# EAGLE schematic oresatt-batteries (EAGLE 7.5.0)
Oresat Battery Management Board v0 Andrew Greenberg Austin Joseph Haneef Mubarak
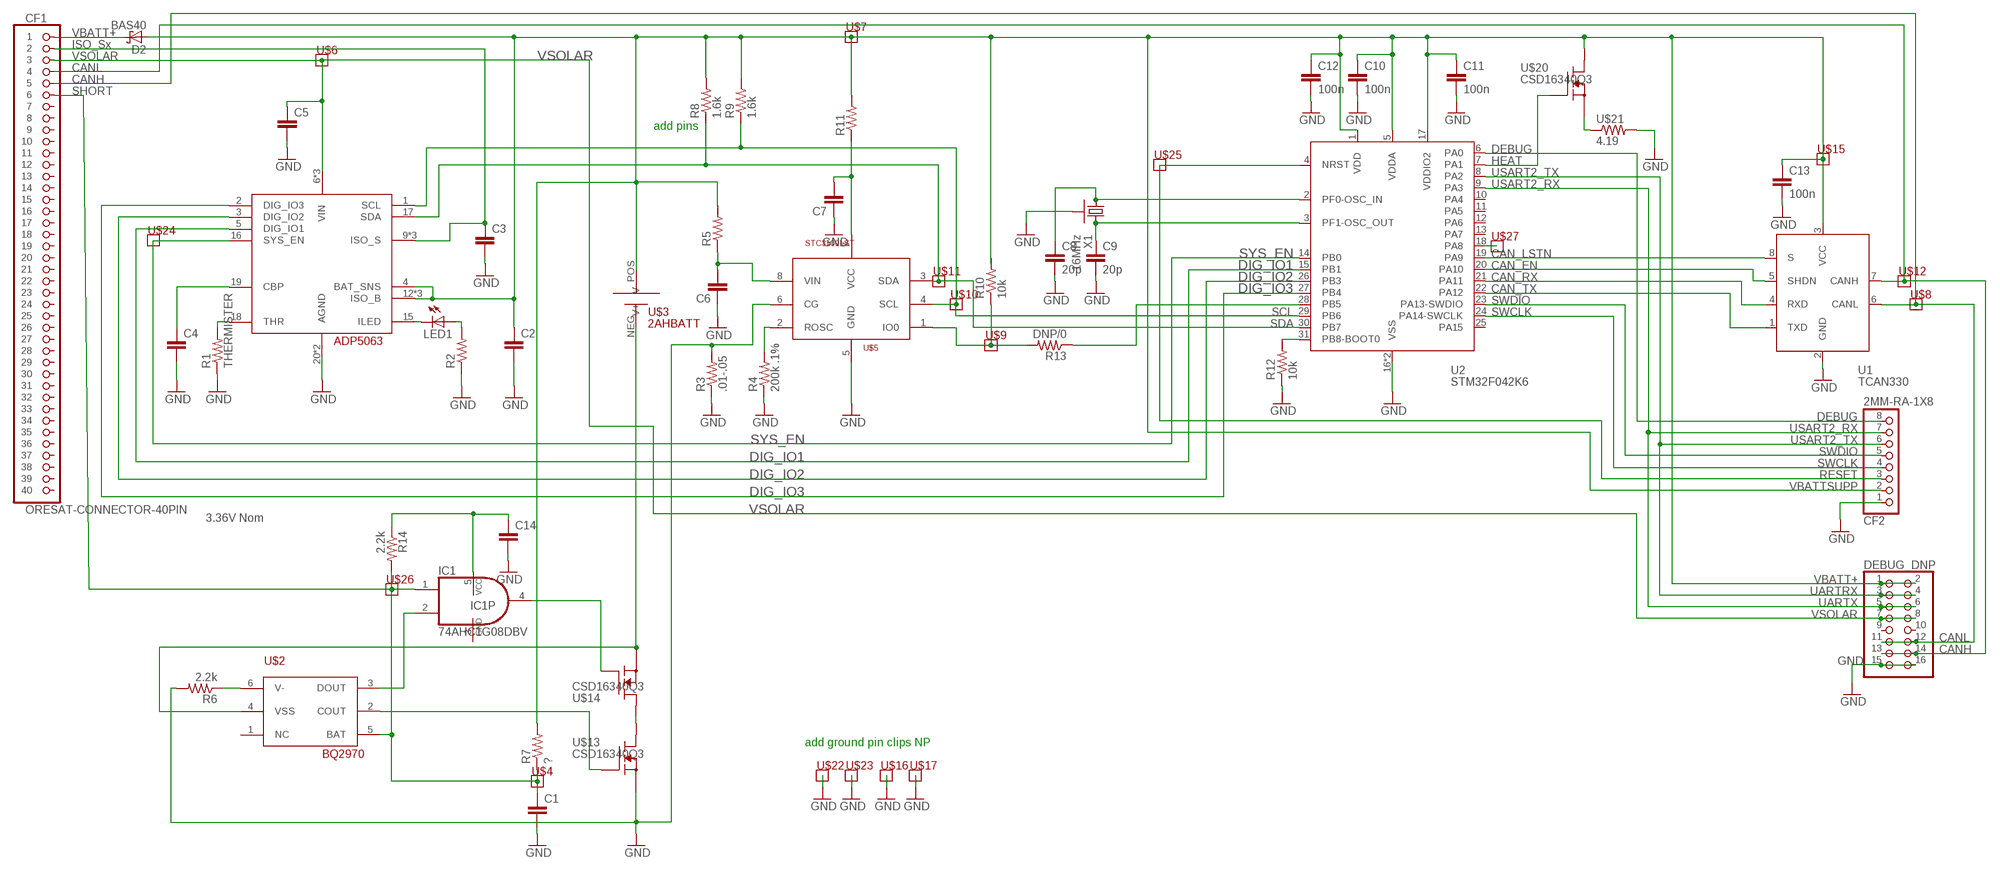
[diagram p0: schematic, sheet 1]

## Parts
C1  C-EUC0603  [C0603]
C2  C-EUC0603  [C0603]
C3  C-EUC0603  [C0603]
C4  C-EUC0603  [C0603]
C5  C-EUC0603  [C0603]
C6  C-EUC0603  [C0603]
C7  C-EUC0603  [C0603]
C8  20p  C-EUC0603  [C0603]
C9  20p  C-EUC0603  [C0603]
C10  100n  C-EUC0603  [C0603]
C11  100n  C-EUC0603  [C0603]
C12  100n  C-EUC0603  [C0603]
C13  100n  C-EUC0603  [C0603]
C14  C-EUC0603  [C0603]
CF1  ORESAT-CONNECTOR-40PIN  [HARWIN-ARCHER-M50-3202045]
CF2  2MM-RA-1X8  [CF-2MM-RA-1X8-PRECIDIP-831]
D2  BAS40  [SOT23]
DEBUG_DNP  PINHD-2X8  [2X08]
IC1  74AHC1G08DBV  [SOT23-5]
LED1  LEDCHIPLED_0603  [CHIPLED_0603]
R1  THERMISTER  R-US_R0603  [R0603]
R2  R-US_R0603  [R0603]
R3  .01-.05  R-US_R0603  [R0603]
R4  200k .1%  R-US_R0603  [R0603]
R5  R-US_R0603  [R0603]
R6  2.2k  R-US_R0603  [R0603]
R7  ?  R-US_R0603  [R0603]
R8  1.6k  R-US_R0603  [R0603]
R9  1.6k  R-US_R0603  [R0603]
R10  10k  R-US_R0603  [R0603]
R11  R-US_R0603  [R0603]
R12  10k  R-US_R0603  [R0603]
R13  DNP/0  R-US_R0603  [R0603]
R14  2.2k  R-US_R0603  [R0603]
U1  TCAN330  [SOT23-8_TI-DCN]
U2  STM32F042K6  [QFP32-7X7]
U$1  ADP5063  [20_4X4_VVTQ]
U$2  BQ2970  [PSOP6]
U$3  2AHBATT  [2AH_605060]
U$4  TP  [2MM_TP]
U$5  STC3100LST  [MINISO-8]
U$6  TP  [2MM_TP]
U$7  TP  [2MM_TP]
U$8  TP  [2MM_TP]
U$9  TP  [2MM_TP]
U$10  TP  [2MM_TP]
U$11  TP  [2MM_TP]
U$12  TP  [2MM_TP]
U$13  CSD16340Q3  [Q3]
U$14  CSD16340Q3  [Q3]
U$15  TP  [2MM_TP]
U$16  TP  [2MM_TP]
U$17  TP  [2MM_TP]
U$20  CSD16340Q3  [Q3]
U$21  4.19  RES_HEATER  [RES_HEATER]
U$22  TP  [2MM_TP]
U$23  TP  [2MM_TP]
U$24  TP  [2MM_TP]
U$25  TP  [2MM_TP]
U$26  TP  [2MM_TP]
U$27  TP  [2MM_TP]
X1  16MHz  CRYSTAL-WITH-GND  [CRYSTAL_2.5X2]

## Nets
ADP_CBP: C4.1 U$1.19(CBP)
ADP_LED: LED1.C U$1.15(ILED)
ADP_THR: R1.2 U$1.18(THR)
BETSHUT: U$13.P$5(D) U$13.P$6(D) U$13.P$7(D) U$13.P$8(D) U$13.P$9(D) U$14.P$5(D) U$14.P$6(D) U$14.P$7(D) U$14.P$8(D) U$14.P$9(D)
BQBAT: C1.1 CF1.P$6 IC1.1(I0) R7.1 R14.2 U$2.5(BAT)
BQVMIN: R6.1 U$2.6(V-)
CAN_EN: U1.5(SHDN) U2.20(PA10)
CAN_LSTN: U1.8(S) U2.19(PA9)
CAN_RX: U1.4(RXD) U2.21(PA11)
CAN_TX: U1.1(TXD) U2.22(PA12)
CANH: CF1.P$4 DEBUG_DNP.13 DEBUG_DNP.14 U1.7(CANH)
CANL: CF1.P$5 DEBUG_DNP.11 DEBUG_DNP.12 U1.6(CANL)
COUT: U$2.2(COUT) U$13.P$4(G)
DIG_IO1: U2.15(PB1) U$1.5(DIG_IO1)
DIG_IO2: U2.26(PB3) U$1.3(DIG_IO2)
DIG_IO3: U2.27(PB4) U$1.2(DIG_IO3)
GND: C1.2 C2.2 C3.2 C4.2 C5.2 C6.1 C7.1 C8.2 C9.2 C10.2 C11.2 C12.2 C13.2 C14.2 CF2.1 DEBUG_DNP.15 DEBUG_DNP.16 R1.1 R2.1 R3.1 R3.2 R4.1 R6.2 R12.1 U1.2(GND) U2.16(VSS) U2.32(VSS) U$1.20(AGND) U$1.P$1(AGND) U$5.5(GND) U$5.6(CG) U$13.P$1(S) U$13.P$2(S) U$13.P$3(S) U$21.V- X1.2(SHIELD) X1.4(SHIELD)
HEAT: U2.7(PA1) U$20.P$4(G)
IO0: R10.1 R13.2 U$5.1(IO0)
ISO_S: C3.1 CF1.P$2 U$1.9(ISO_S) U$1.10(ISO_S) U$1.11(ISO_S)
LEDNP: LED1.A R2.2
N$1: C7.2 R11.1 U$5.7(VCC)
N$2: R12.2 U2.31(PB8-BOOT0)
N$3: IC1.4(O) U$14.P$4(G)
N$4: CF1.P$1 D2.3(C)
N$5: IC1.2(I1) U$2.3(DOUT)
N$6: C14.1 IC1.5(VCC) R14.1
N$13: U$20.P$1(S) U$20.P$2(S) U$20.P$3(S) U$21.V+
NRESET: CF2.3 U2.4(NRST)
OSC_IN: C8.1 U2.2(PF0-OSC_IN) X1.1
OSC_OUT: C9.1 U2.3(PF1-OSC_OUT) X1.3
PA8: U2.18(PA8)
ROSC: R4.2 U$5.2(ROSC)
SCL: R9.1 U2.29(PB6) U$1.1(SCL) U$5.4(SCL)
SDA: R8.1 U2.30(PB7) U$1.17(SDA) U$5.3(SDA)
STC_CG: U$2.4(VSS) U$3.NEG(V-) U$14.P$1(S) U$14.P$2(S) U$14.P$3(S)
STC_IO: R13.1 U2.28(PB5)
STC_VIN: C6.2 R5.1 U$5.8(VIN)
STM_DEBUG: CF2.8 U2.6(PA0)
SWCLK: CF2.4 U2.24(PA14-SWCLK)
SWDIO: CF2.5 U2.23(PA13-SWDIO)
SYS_EN: U2.14(PB0) U$1.16(SYS_EN)
USART2_RX: CF2.7 DEBUG_DNP.5 DEBUG_DNP.6 U2.9(PA3)
USART2_TX: CF2.6 DEBUG_DNP.3 DEBUG_DNP.4 U2.8(PA2)
VBATT+: C2.1 C10.1 C11.1 C12.1 C13.1 CF2.2 D2.1(A) DEBUG_DNP.1 DEBUG_DNP.2 R5.2 R7.2 R8.2 R9.2 R11.2 U1.3(VCC) U2.1(VDD) U2.5(VDDA) U2.17(VDDIO2) U$1.4(BAT_SNS) U$1.12(ISO_B) U$1.13(ISO_B) U$1.14(ISO_B) U$3.POS(V+) U$20.P$5(D) U$20.P$6(D) U$20.P$7(D) U$20.P$8(D) U$20.P$9(D)
VSOLAR: C5.1 CF1.P$3 DEBUG_DNP.7 DEBUG_DNP.8 U$1.6(VIN) U$1.7(VIN) U$1.8(VIN)
Unconnected: CF1.P$7 CF1.P$8 CF1.P$9 CF1.P$10 CF1.P$11 CF1.P$12 CF1.P$13 CF1.P$14 CF1.P$15 CF1.P$16 CF1.P$17 CF1.P$18 CF1.P$19 CF1.P$20 CF1.P$21 CF1.P$22 CF1.P$23 CF1.P$24 CF1.P$25 CF1.P$26 CF1.P$27 CF1.P$28 CF1.P$29 CF1.P$30 CF1.P$31 CF1.P$32 CF1.P$33 CF1.P$34 CF1.P$35 CF1.P$36 CF1.P$37 CF1.P$38 CF1.P$39 CF1.P$40 DEBUG_DNP.9 DEBUG_DNP.10 R10.2 U2.10(PA4) U2.11(PA5) U2.12(PA6) U2.13(PA7) U2.25(PA15) U$2.1(NC)

## Notes on the sheet
- VBATT+
- ISO_Sx
- VSOLAR | VSOLAR
- CANL
- CANH
- SHORT
- add pins
- DEBUG
- HEAT
- USART2_TX
- USART2_RX
- SYS_EN | CAN_LSTN
- DIG_IO1 | CAN_EN
- DIG_IO2 | CAN_RX
- DIG_IO3 | CAN_TX
- SWDIO
- SCL | SWCLK
- SDA
- DEBUG
- USART2_RX
- SYS_EN | USART2_TX
- SWDIO
- DIG_IO1
- SWCLK
- DIG_IO2 | RESET
- VBATTSUPP
- DIG_IO3
- 3.36V Nom | VSOLAR
- VBATT+
- UARTRX
- UARTX
- VSOLAR
- CANL
- CANH
- GND
- add ground pin clips NP

## Power pins joined to a net without a drawn wire
GND: IC1.3(GND)

## Library data of the parts
C1-C14 = rcl:C-EU: CAPACITOR, European symbol
CF1 = low-gain-radio:ORESAT-CONNECTOR-40PIN: OreSat 40pin card connector. Uses the Harwin Archer M50-3202045.
CF2 = oresat-batteries:2MM-RA-1X8
D2 = diode:BAS40: Silicon Schottky Diodes General-purpose diode for high-speed switching
DEBUG_DNP = pinhead:PINHD-2X8: PIN HEADER
IC1 = 74xx-little-us:74*1G08: 2-input AND gate
LED1 = led:LED: LED OSRAM: - CHIPLED LG R971, LG N971, LY N971, LG Q971, LY Q971, LO R971, LY R971 LH N974, LH R974 LS Q976, LO Q976, LY Q976 LO Q996 - Hyper CHIPLED LW Q18S LB Q993, LB Q99A, LB R99A - SideLED LS A670, LO A670, LY A670, LG A670, LP A670 LB A673, LV A673, LT A673, LW A673 LH A674 LY A675 LS A676, LA A676, LO A676, LY A676, LW A676 LS A679, LY A679, LG A679 - Hyper Micro SIDELED® LS Y876, LA Y876, LO Y876, LY Y876 LT Y87S - SmartLED LW L88C, LW L88S LB L89C, LB L89S, LG L890 LS L89K, LO L89K, LY L89K LS L896, LA L896, LO L896, LY L896 - TOPLED LS T670, LO T670, LY T670, LG T670, LP T670 LSG T670, LSP T670, LSY T670, LOP T670, LYG T670 LG T671, LOG T671, LSG T671 LB T673, LV T673, LT T673, LW T673 LH T674 LS T676, LA T676, LO T676, LY T676, LB T676, LH T676, LSB T676, LW T676 LB T67C, LV T67C, LT T67C, LS T67K, LO T67K, LY T67K, LW E67C LS E67B, LA E67B, LO E67B, LY E67B, LB E67C, LV E67C, LT E67C LW T67C LS T679, LY T679, LG T679 LS T770, LO T770, LY T770, LG T770, LP T770 LB T773, LV T773, LT T773, LW T773 LH T774 LS E675, LA E675, LY E675, LS T675 LS T776, LA T776, LO T776, LY T776, LB T776 LHGB T686 LT T68C, LB T68C - Hyper Mini TOPLED® LB M676 - Mini TOPLED Santana® LG M470 LS M47K, LO M47K, LY M47K Source: http://www.osram.convergy.de LUXEON: - LUMILED® LXK2-PW12-R00, LXK2-PW12-S00, LXK2-PW14-U00, LXK2-PW14-V00 LXK2-PM12-R00, LXK2-PM12-S00, LXK2-PM14-U00 LXK2-PE12-Q00, LXK2-PE12-R00, LXK2-PE12-S00, LXK2-PE14-T00, LXK2-PE14-U00 LXK2-PB12-K00, LXK2-PB12-L00, LXK2-PB12-M00, LXK2-PB14-N00, LXK2-PB14-P00, LXK2-PB14-Q00 LXK2-PR12-L00, LXK2-PR12-M00, LXK2-PR14-Q00, LXK2-PR14-R00 LXK2-PD12-Q00, LXK2-PD12-R00, LXK2-PD12-S00 LXK2-PH12-R00, LXK2-PH12-S00 LXK2-PL12-P00, LXK2-PL12-Q00, LXK2-PL12-R00 Source: www.luxeon.com KINGBRIGHT: KA-3528ASYC Source: www.kingbright.com
R1-R14 = rcl:R-US_: RESISTOR, American symbol
U1 = oresat-batteries:TCAN330
U2 = oresat-batteries:STM32F042K6
U$1 = oresat-batteries:ADP5063
U$2 = oresat-batteries:BQ2970
U$3 = oresat-batteries:2AHBATT
U$4 U$6-U$12 U$15-U$17 U$22-U$27 = oresat-batteries:TP
U$5 = oresat-batteries:STC3100LST
U$13 U$14 U$20 = oresat-batteries:CSD16340Q3
U$21 = oresat-batteries:RES_HEATER
X1 = low-gain-radio:CRYSTAL-WITH-GND